# EAGLE design Mainboard v2 (EAGLE 6.6.0)
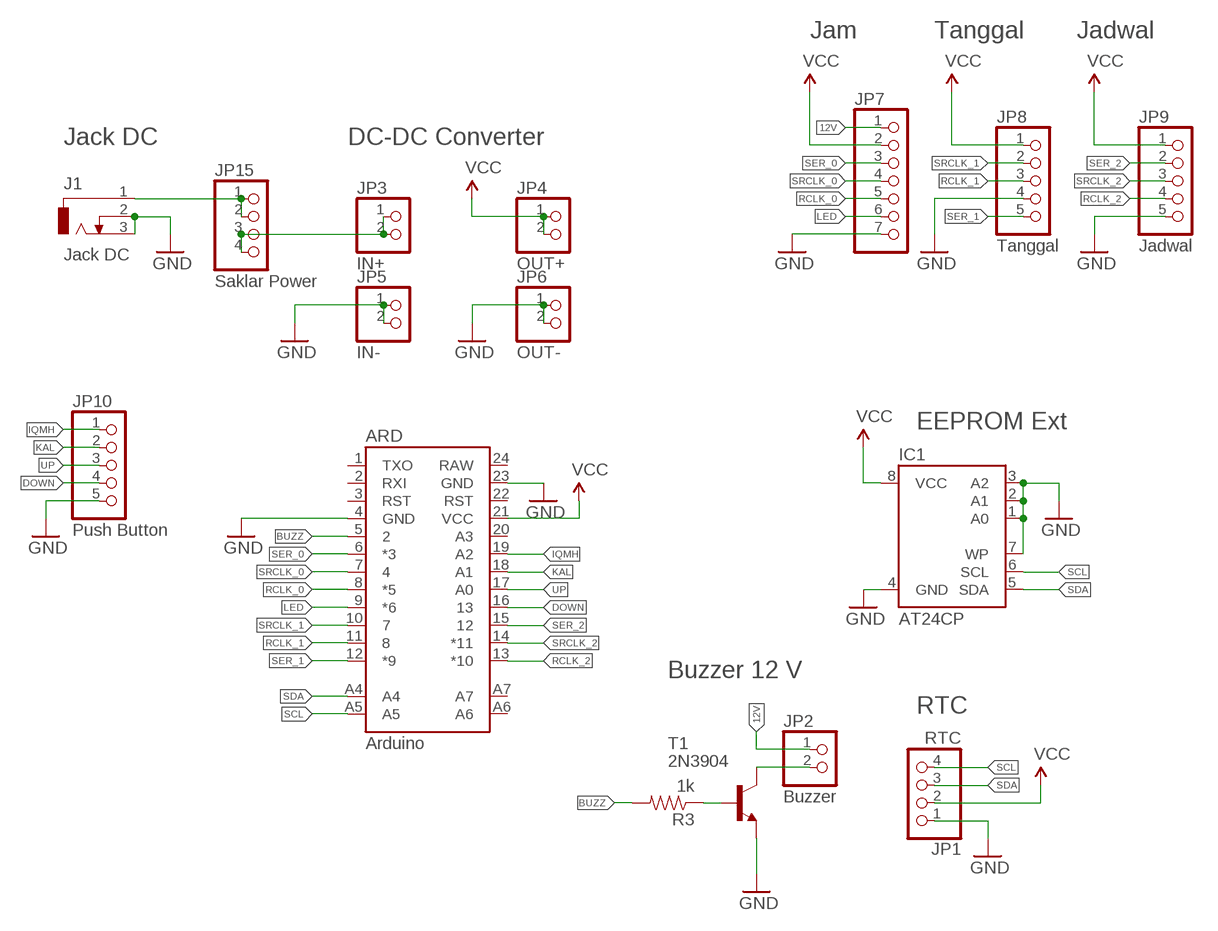
[diagram p0: schematic, sheet 1]

## Parts
ARD  Arduino  ARDUINO_PRO_MINIARDUINO_PRO_MINI_MODIFIED  [ARDUINO_PRO_MINI]
IC1  AT24CP  [DIL08]
J1  Jack DC  DCJ0202  [DCJ0202]
JP1  RTC  PINHD-1X4  [1X04]
JP2  Buzzer  PINHD-1X2  [1X02]
JP3  IN+  PINHD-1X2  [1X02]
JP4  OUT+  PINHD-1X2  [1X02]
JP5  IN-  PINHD-1X2  [1X02]
JP6  OUT-  PINHD-1X2  [1X02]
JP7  PINHD-1X7  [1X07]
JP8  Tanggal  PINHD-1X5  [1X05]
JP9  Jadwal  PINHD-1X5  [1X05]
JP10  Push Button  PINHD-1X5  [1X05]
JP15  Saklar Power  PINHD-1X4  [1X04]
R3  1k  RESISTORPTH-1/4W  [AXIAL-0.4]
T1  2N3904  [TO92]

## Nets
12V: JP2.1 JP3.1 JP3.2 JP7.1 JP15.3 JP15.4
BUZZ: ARD.5 R3.P$2
DOWN: ARD.16 JP10.4
GND: ARD.4(GND) ARD.23(GND) IC1.1(A0) IC1.2(A1) IC1.3(A2) IC1.4(GND) IC1.7(WP) J1.2 J1.3 JP1.1 JP5.1 JP5.2 JP6.1 JP6.2 JP7.7 JP8.4 JP9.5 JP10.5 T1.3(E)
IQMH: ARD.19(A2) JP10.1
KAL: ARD.18(A1) JP10.2
LED: ARD.9(*6) JP7.6
N$1: R3.P$1 T1.2(B)
N$2: J1.1 JP15.1 JP15.2
N$3: JP2.2 T1.1(C)
RCLK_0: ARD.8(*5) JP7.5
RCLK_1: ARD.11 JP8.3
RCLK_2: ARD.13(*10) JP9.4
SCL: ARD.A5 IC1.6(SCL) JP1.4
SDA: ARD.A4 IC1.5(SDA) JP1.3
SER_0: ARD.6(*3) JP7.3
SER_1: ARD.12(*9) JP8.5
SER_2: ARD.15 JP9.2
SRCLK_0: ARD.7 JP7.4
SRCLK_1: ARD.10 JP8.2
SRCLK_2: ARD.14(*11) JP9.3
UP: ARD.17(A0) JP10.3
VCC: ARD.21(VCC) IC1.8(VCC) JP1.2 JP4.1 JP4.2 JP7.2 JP8.1 JP9.1
Unconnected: ARD.1(TXO) ARD.2(RXI) ARD.3(RST) ARD.20(A3) ARD.22(RST) ARD.24(RAW) ARD.A6 ARD.A7

## Notes on the sheet
- Jam | Tanggal | Jadwal
- Jack DC | DC-DC Converter
- EEPROM Ext
- Buzzer 12 V
- RTC

## Library data of the parts
ARD = SparkFun-Boards:ARDUINO_PRO_MINI
IC1 = atmel:AT24C*: 2-wire serial EEPROM; MPN: AT24C1024BW-SH-B; OC_FARNELL: 1362646; OC_NEWARK: 03P2044
J1 = con-jack:DCJ0202: DC POWER JACK Source: DCJ0202.pdf; OC_FARNELL: unknown; OC_NEWARK: unknown
JP1 JP15 = pinhead:PINHD-1X4: PIN HEADER
JP2-JP6 = pinhead:PINHD-1X2: PIN HEADER
JP7 = pinhead:PINHD-1X7: PIN HEADER
JP8-JP10 = pinhead:PINHD-1X5: PIN HEADER
R3 = SparkFun-Resistors:RESISTOR: Resistor Basic schematic elements and footprints for 0603, 1206, and PTH resistors.
T1 = transistor-neu-to92:2N3904: NPN TRANSISTOR

## Board
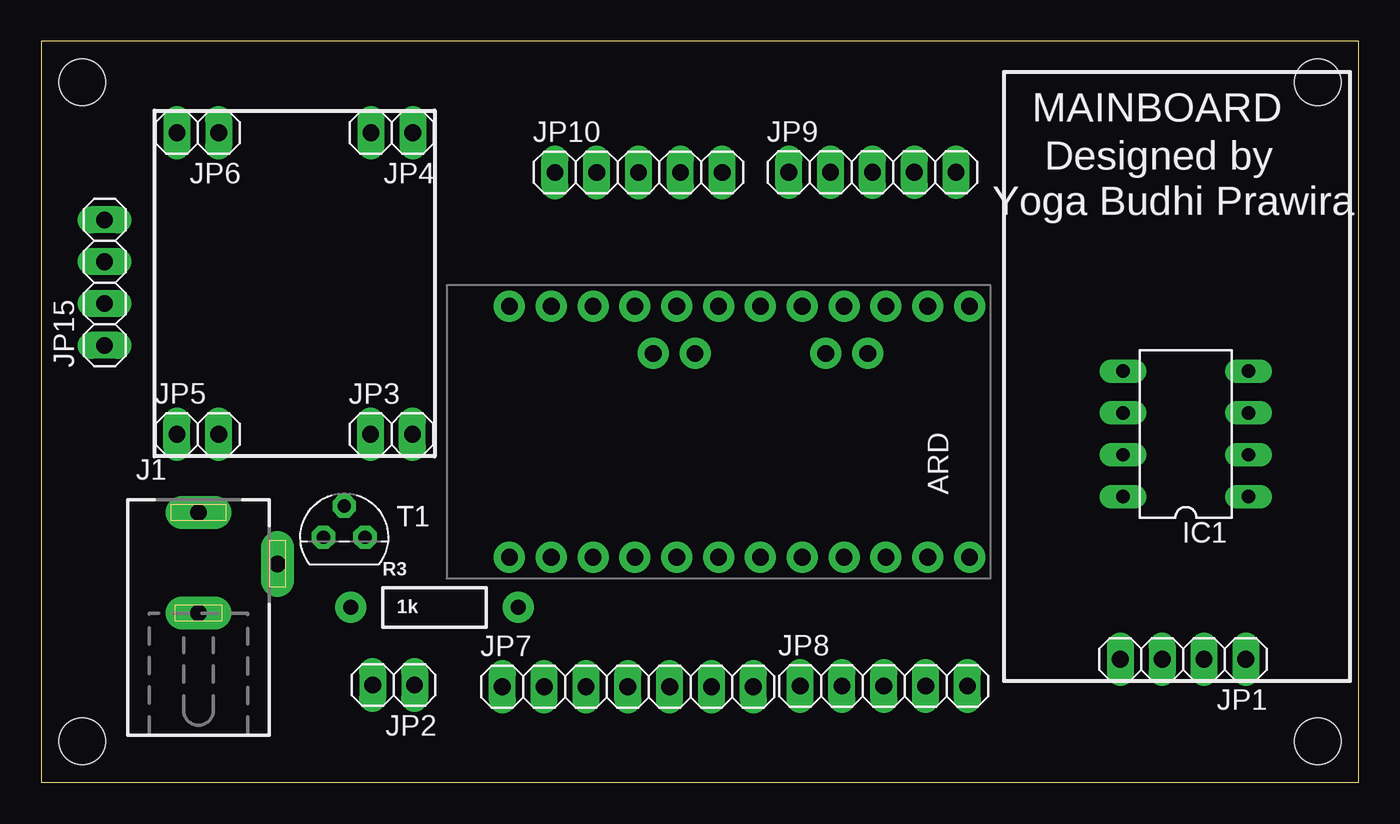
[diagram p1: board, top side]
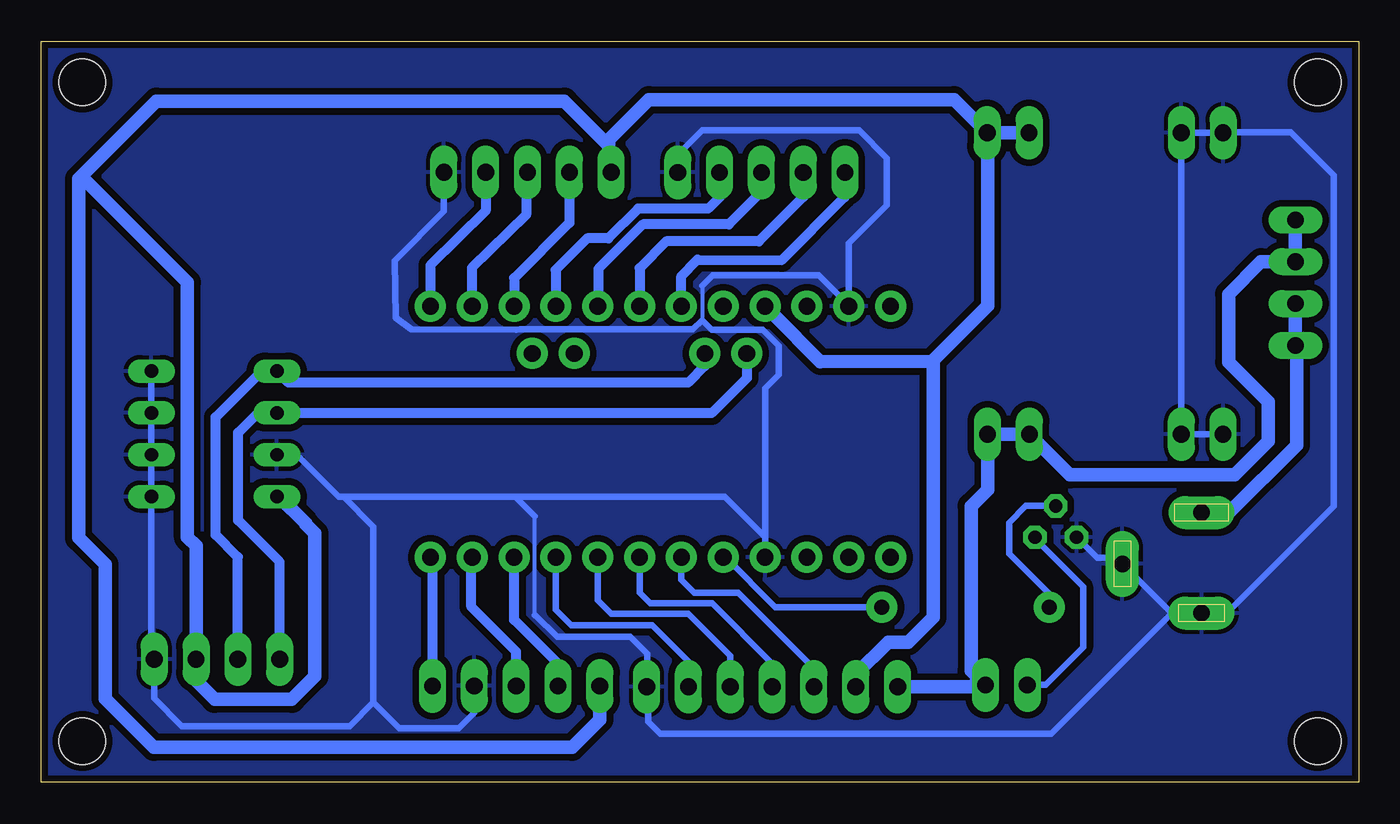
[diagram p2: board, bottom side, seen from below]

Size 80 x 45 mm. Coordinates in mm from the lower left corner, seen from the top.
Outline: 0,0 80,0 80,45 0,45 0,0
Copper layers (1*16): Top 0.035mm / dielectric 1.5mm / Bottom 0.035mm
Design rules "SparkFun": minimum track width 8mil, minimum drill 20mil, track to track 8mil, track to pad 8mil, pad to pad 8mil, via to via 8mil, smd to smd 8mil, copper to edge 8mil, drill to drill 8mil, minimum pad ring 12mil, minimum via ring 10mil, stop-mask expansion 4mil, vias tented up to drill 20mil, thermal gap 10mil
Holes 2.8 mm at 2.5,42.5 77.5,42.5 77.5,2.5 2.5,2.5

### Footprints (pad centres in the part's own frame; a part is rotated, then mirrored left to right if it is on the bottom)
ARDUINO_PRO_MINI = drill 1.016 pad 1.88: 1 -7.62,12.7; 2 -7.62,10.16; 3 -7.62,7.62; 4 -7.62,5.08; 5 -7.62,2.54; 6 -7.62,0; 7 -7.62,-2.54; 8 -7.62,-5.08; 9 -7.62,-7.62; 10 -7.62,-10.16; 11 -7.62,-12.7; 12 -7.62,-15.24; 13 7.62,-15.24; 14 7.62,-12.7; 15 7.62,-10.16; 16 7.62,-7.62; 17 7.62,-5.08; 18 7.62,-2.54; 19 7.62,0; 20 7.62,2.54; 21 7.62,5.08; 22 7.62,7.62; 23 7.62,10.16; 24 7.62,12.7; A4 4.763,1.429; A5 4.763,3.969; A6 4.763,-9.049; A7 4.763,-6.509
DIL08 = drill 0.813 long: 1 -3.81,-3.81; 2 -1.27,-3.81; 3 1.27,-3.81; 4 3.81,-3.81; 5 3.81,3.81; 6 1.27,3.81; 7 -1.27,3.81; 8 -3.81,3.81
DCJ0202 = drill 1 pad 2 long: 1 0,3.1; 2 4.8,0; 3 0,-3
1X04 = drill 1.016 long: 1 -3.81,0; 2 -1.27,0; 3 1.27,0; 4 3.81,0
1X02 = drill 1.016 long: 1 -1.27,0; 2 1.27,0
1X07 = drill 1.016 long: 1 -7.62,0; 2 -5.08,0; 3 -2.54,0; 4 0,0; 5 2.54,0; 6 5.08,0; 7 7.62,0
1X05 = drill 1.016 long: 1 -5.08,0; 2 -2.54,0; 3 0,0; 4 2.54,0; 5 5.08,0
AXIAL-0.4 = drill 0.9 pad 1.88: P$1 -5.08,0; P$2 5.08,0
TO92 = drill 0.813 octagon: 1 1.27,0; 2 0,1.905; 3 -1.27,0

### Placement (x,y rotation side)
ARD  41.13,21.28 90 top
IC1  69.5,21.16 90 top
J1  9.55,13.27 0 top
JP1  69.33,7.48 180 top
JP2  21.4,5.91 180 top
JP3  21.27,21.13 0 top
JP4  21.29,39.44 180 top
JP5  9.51,21.14 0 top
JP6  9.51,39.44 180 top
JP7  35.62,5.81 0 top
JP8  51.16,5.85 0 top
JP9  50.47,37.04 0 top
JP10  36.27,37.03 0 top
JP15  3.85,30.34 90 top
R3  23.88,10.63 0 top
T1  18.4,14.88 0 top

### Tracks (layer width: path | path; a pad name or v marks a point on that pad's centre or on a via)
12V
  Bottom 0.813: 23.04,6.28 23.54,6.78 23.54,16.77 22.54,17.77 JP3.2 JP3.1 17.54,18.67 7.54,18.67 5.5,20.71 5.5,23.1 7.91,25.51 7.91,29.65 5.95,31.61 JP15.3 JP15.4 | 23.04,6.28 JP2.1 | JP7.1 23.5,5.81 23.04,6.28
BUZZ
  Bottom 0.406: ARD.5 38.45,13.66 35.43,10.64 R3.P$2
DOWN
  Bottom 0.61: JP10.4 38.81,35.52 39.5,34.83 43.76,34.83 45.56,33.03 46.86,33.03 48.77,31.12 48.77,28.92 ARD.16
GND
  Bottom 0.254: 39.86,30.14 39.86,28.06 | 50.02,10.15 50.02,16.15
  Bottom 0.406: JP9.5 55.55,34.67 58.52,31.67 58.48,28.2 57.54,27.51 51.15,27.48 50.92,27.5 40.43,27.5 39.86,28.06 39.28,27.47 36.2,27.47 35.23,26.5 35.23,24.76 36.05,23.94 ARD.4 36.05,14.89 38.5,17.34 51.21,17.34 | JP10.5 41.4,37.08 41.4,38.03 39.85,39.58 30.34,39.58 28.66,37.9 28.66,35.04 30.97,32.73 ARD.23 30.97,28.98 32.78,30.79 39.22,30.79 39.86,30.14 | 50.02,10.15 49.99,10.15 48.67,8.83 44.24,8.83 43.21,7.8 43.21,5.84 JP7.7 43.13,5.7 43.13,3.67 42.4,2.94 18.68,2.94 11.35,10.27 | T1.3 15.89,13.64 14.72,13.64 J1.2 11.35,10.27 | JP5.1 JP5.2 JP6.1 JP6.2 7.68,39.44 7.64,39.48 4.14,39.48 1.53,36.87 1.53,16.75 8.11,10.17 9.45,10.17 J1.3 11.35,10.27 | 51.21,17.34 61.64,17.34 | IC1.7 65.66,19.86 64.46,19.86 61.94,17.34 61.64,17.34 | JP8.4 53.7,4.23 54.64,3.29 58.27,3.29 59.83,4.85 | 59.83,4.85 59.83,15.53 61.64,17.34 | 50.02,16.15 51.21,17.34 | 73.14,17.18 IC1.1 | IC1.4 IC1.3 IC1.2 IC1.1 | 59.83,4.85 61.26,3.42 71.46,3.42 73.14,5.1 JP1.1 73.31,7.65 IC1.1
  pour Bottom (isolate 0.406): 0,45 80,45 80,0 0,0
IQMH
  Bottom 0.61: ARD.19 41.13,30.74 40.16,31.73 35.04,31.71 31.23,35.52 31.23,36.99 JP10.1
KAL
  Bottom 0.61: JP10.2 33.73,35.54 36.43,32.84 42.06,32.84 43.67,31.22 ARD.18
LED
  Bottom 0.406: ARD.9 48.75,10.47 47.81,9.53 42.9,9.53 40.71,7.34 JP7.6
N$1
  Bottom 0.406: R3.P$1 18.8,11.45 21.23,13.88 21.23,15.77 20.21,16.79 T1.2
N$2
  Bottom 0.813: JP15.2 JP15.1 3.78,26.46 3.78,20.48 7.89,16.37 J1.1
N$3
  Bottom 0.406: T1.1 19.67,14.81 16.74,11.88 16.74,8.19 19,5.93 20.11,5.93 JP2.2
RCLK_0
  Bottom 0.406: ARD.8 46.21,11.07 45.39,10.25 40.71,10.25 38.16,7.7 JP7.5
RCLK_1
  Bottom 0.61: JP8.3 51.16,7.93 53.88,10.65 53.88,13.61 ARD.11
RCLK_2
  Bottom 0.61: JP9.4 53.01,34.7 56.37,31.39 ARD.13
SCL
  Bottom 0.61: JP1.4 65.52,13.38 68.05,15.91 68.05,21.23 66.77,22.51 65.77,22.51 IC1.6 39.29,22.42 37.16,24.55 ARD.A5
SDA
  Bottom 0.61: JP1.3 68.06,13.67 69.41,15.02 69.41,22.17 66.61,24.97 IC1.5 64.99,24.27 40.72,24.27 39.7,25.29 ARD.A4
SER_0
  Bottom 0.406: ARD.6 41.13,12.3 40.34,11.51 37.68,11.51 33.09,6.92 JP7.3
SER_1
  Bottom 0.61: JP8.5 56.24,13.53 ARD.12
SER_2
  Bottom 0.61: JP9.2 47.93,33.97 51.28,30.62 ARD.15
SRCLK_0
  Bottom 0.406: ARD.7 43.67,11.52 43.01,10.86 39.26,10.86 35.61,7.21 JP7.4
SRCLK_1
  Bottom 0.61: JP8.2 48.62,7.2 51.29,9.87 ARD.10
SRCLK_2
  Bottom 0.61: JP9.3 50.47,36.59 50.55,36.51 50.55,34.45 53.85,31.24 53.85,28.97 ARD.14
UP
  Bottom 0.61: JP10.3 36.27,35.85 38.25,33.87 43.47,33.87 46.17,31.17 46.17,28.94 ARD.17
VCC
  Bottom 0.813: JP4.2 JP4.1 | JP9.1 45.53,37.17 45.53,38.65 | 45.53,38.65 45.53,39.02 43.1,41.45 24.57,41.45 JP4.1 | ARD.21 35.55,28.41 32.69,25.55 25.9,25.57 | 25.9,25.57 22.54,28.93 22.54,39.42 JP4.1 | 25.9,25.57 25.85,25.52 25.85,10.02 27.36,8.51 28.58,8.51 30.54,6.55 JP7.2 | JP8.1 46.08,3.81 47.76,2.13 73.15,2.13 76.11,5.09 76.11,13.23 77.72,14.84 77.72,36.64 77.57,36.79 | 77.57,36.79 73,41.36 48.24,41.36 45.53,38.65 | IC1.8 65.58,17.35 63.95,15.72 63.95,15.68 63.38,15.11 63.38,6.44 64.78,5.04 69.47,5.04 70.6,6.17 JP1.2 70.6,14.35 71.13,14.88 71.13,30.35 77.57,36.79

### Text on the board
tNames: MAINBOARD | Designed by | Yoga Budhi Prawira